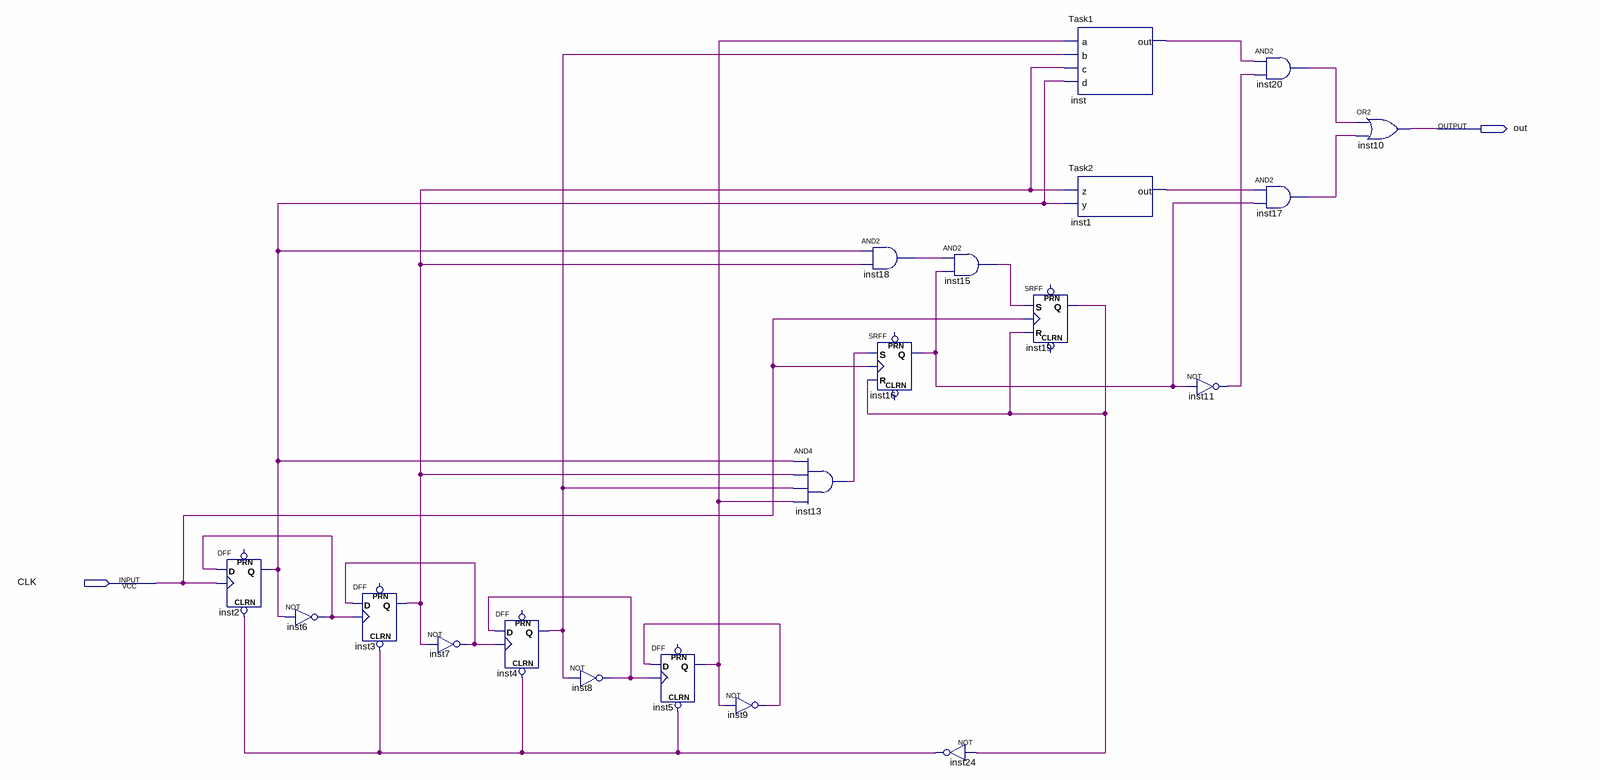
[diagram p0: schematic sheet]
// Quartus schematic Lab2.bdf as structural Verilog: 20 symbols, 2 pins
module Lab2 (
  input  CLK,
  output out
);

  wire inst1_out, inst2_q, inst3_q, inst4_q, inst5_q, inst6_out, inst7_out, inst8_out, inst9_out, inst11_out,
       inst13_out, inst15_out, inst16_q, inst17_out, inst18_out, inst19_q, inst20_out, inst24_out, inst_out;

  DFF inst2 (.CLRN(inst24_out), .CLK(CLK), .D(inst6_out), .Q(inst2_q));  // open: PRN
  not inst6 (inst6_out, inst2_q);
  DFF inst3 (.CLRN(inst24_out), .CLK(inst6_out), .D(inst7_out), .Q(inst3_q));  // open: PRN
  not inst7 (inst7_out, inst3_q);
  DFF inst4 (.CLRN(inst24_out), .CLK(inst7_out), .D(inst8_out), .Q(inst4_q));  // open: PRN
  not inst8 (inst8_out, inst4_q);
  DFF inst5 (.CLRN(inst24_out), .CLK(inst8_out), .D(inst9_out), .Q(inst5_q));  // open: PRN
  not inst9 (inst9_out, inst5_q);
  and inst13 (inst13_out, inst2_q, inst3_q, inst4_q, inst5_q);
  and inst18 (inst18_out, inst2_q, inst3_q);
  SRFF inst16 (.S(inst13_out), .R(inst19_q), .CLK(CLK), .Q(inst16_q));  // open: PRN, CLRN
  and inst15 (inst15_out, inst18_out, inst16_q);
  not inst24 (inst24_out, inst19_q);
  SRFF inst19 (.S(inst15_out), .R(inst19_q), .CLK(CLK), .Q(inst19_q));  // open: PRN, CLRN
  Task1 inst (.a(inst5_q), .b(inst4_q), .c(inst3_q), .d(inst2_q), .out(inst_out));
  Task2 inst1 (.z(inst3_q), .y(inst2_q), .out(inst1_out));
  not inst11 (inst11_out, inst16_q);
  and inst20 (inst20_out, inst_out, inst11_out);
  and inst17 (inst17_out, inst1_out, inst16_q);
  or inst10 (out, inst20_out, inst17_out);
endmodule
